# EasyEDA Pro project Armour_Round.eprj, board PCB1
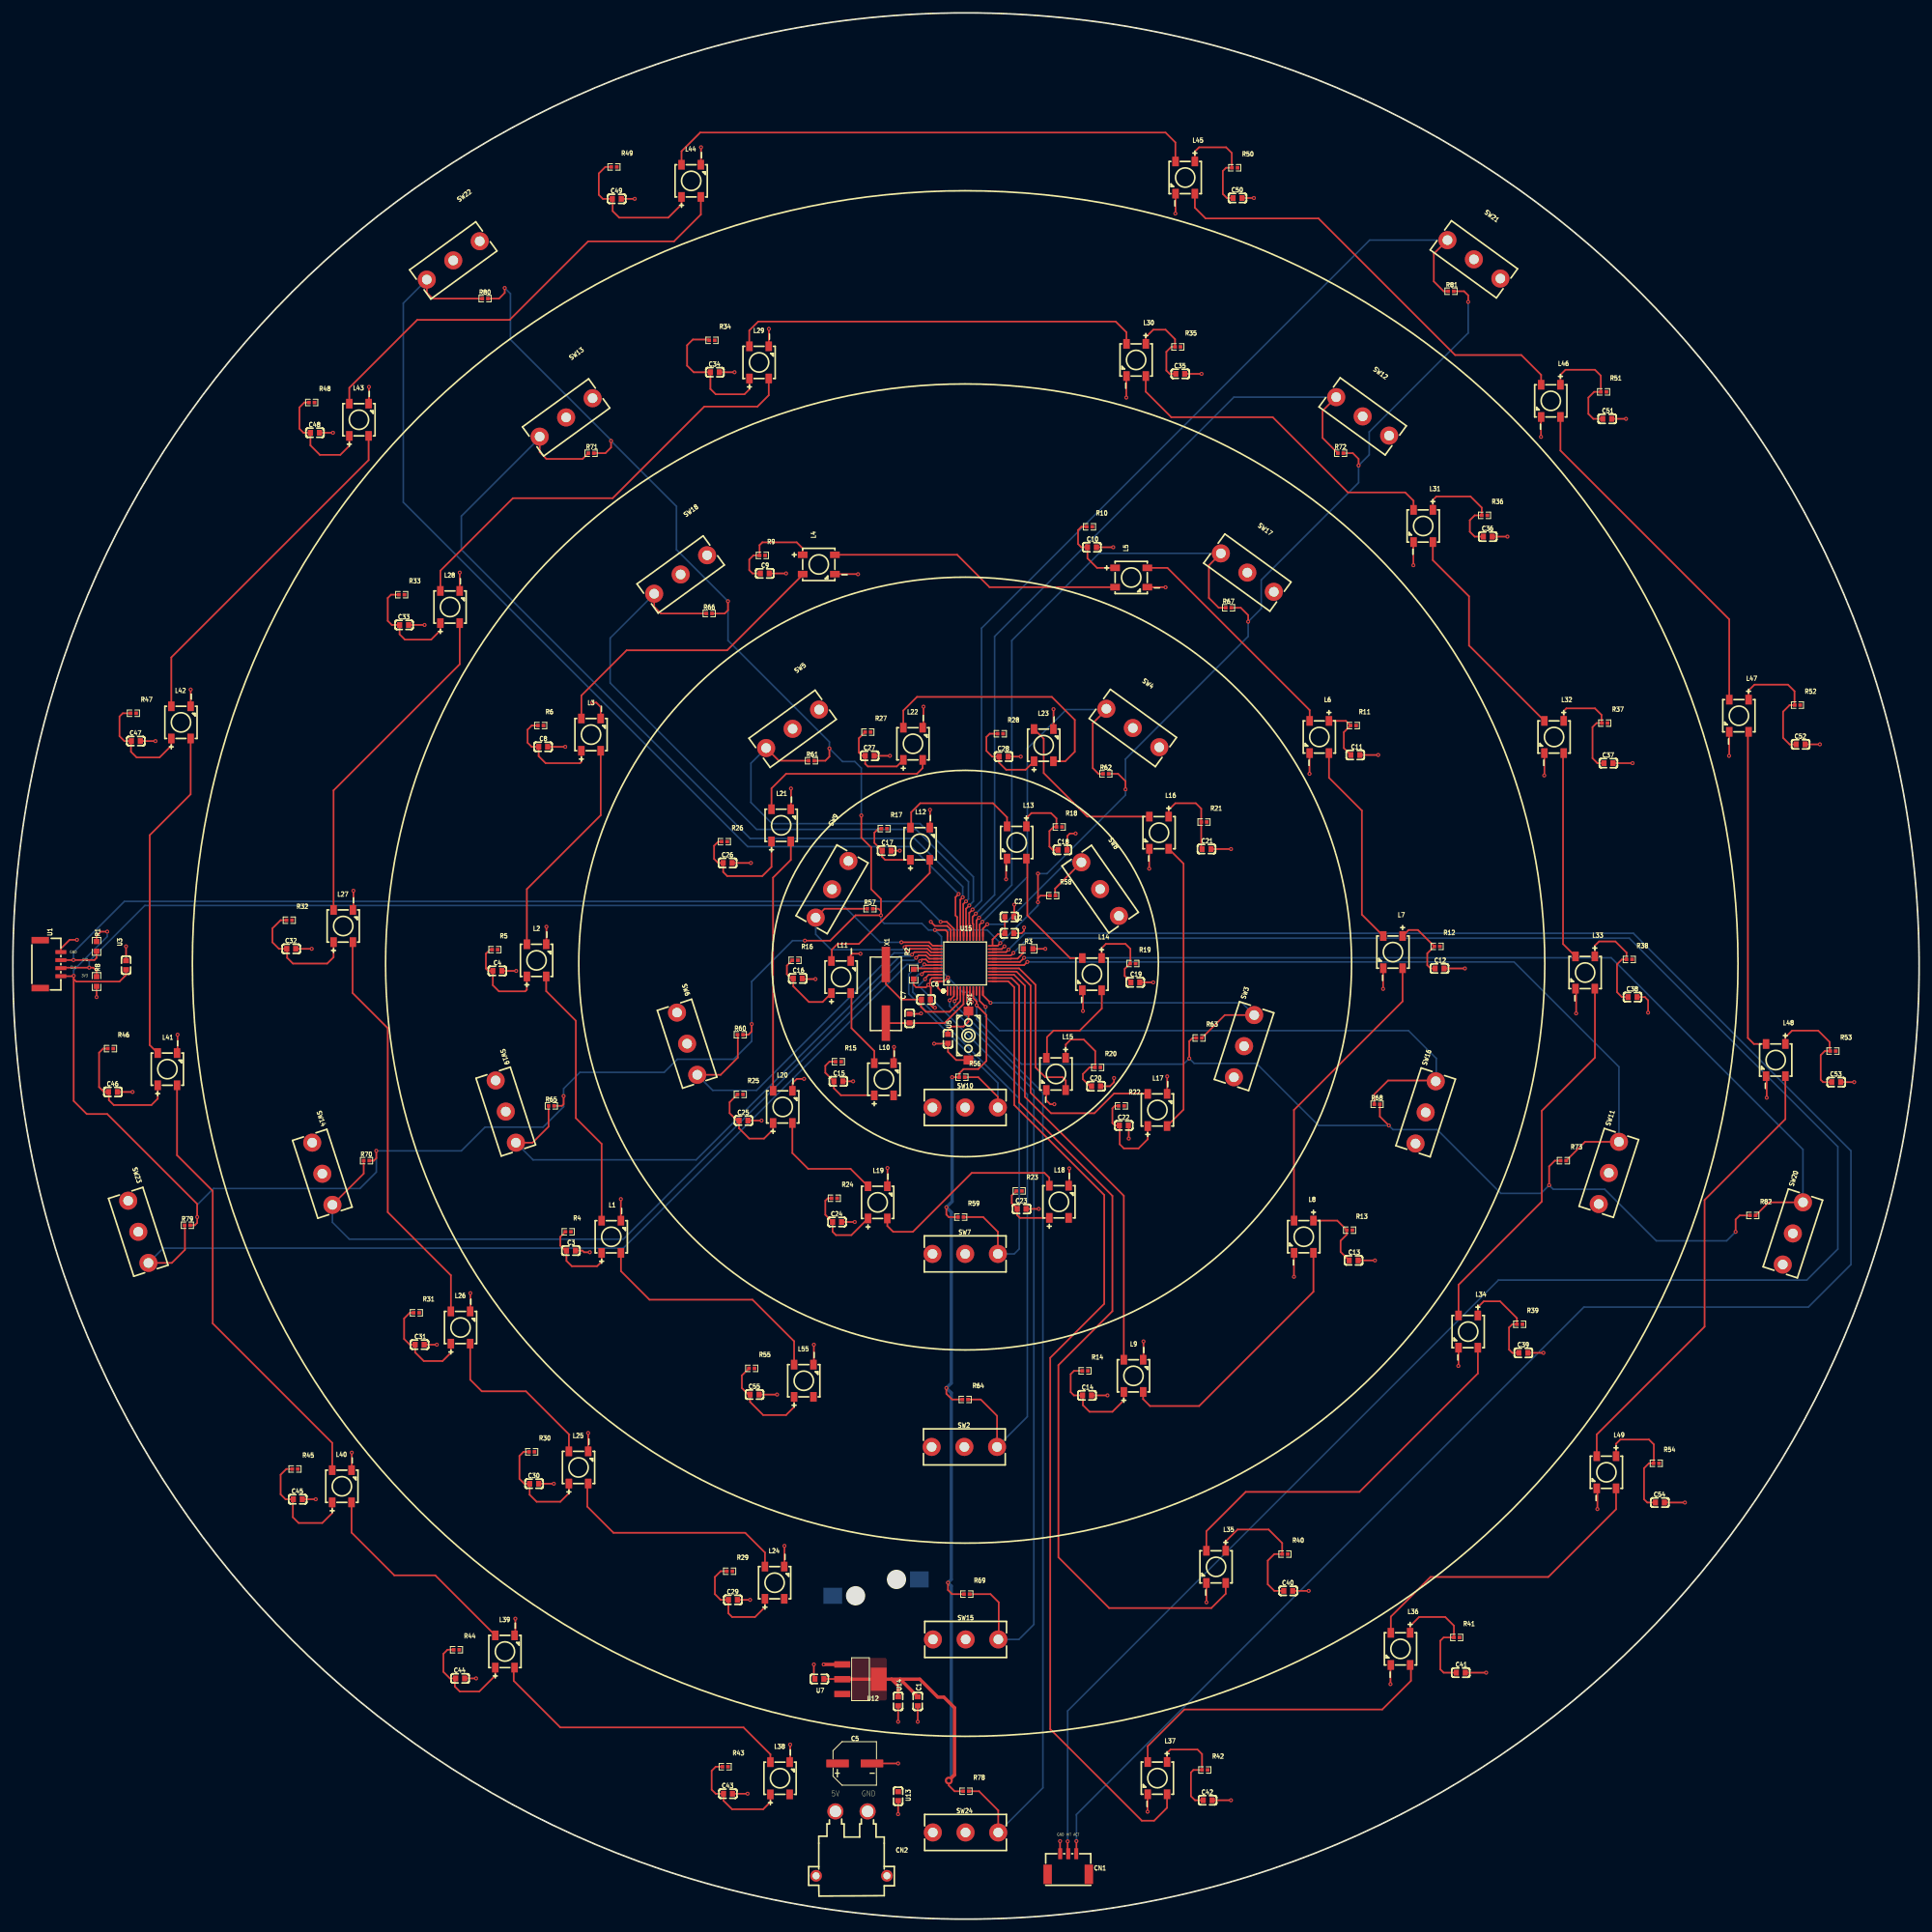
[diagram p1: board, top side]
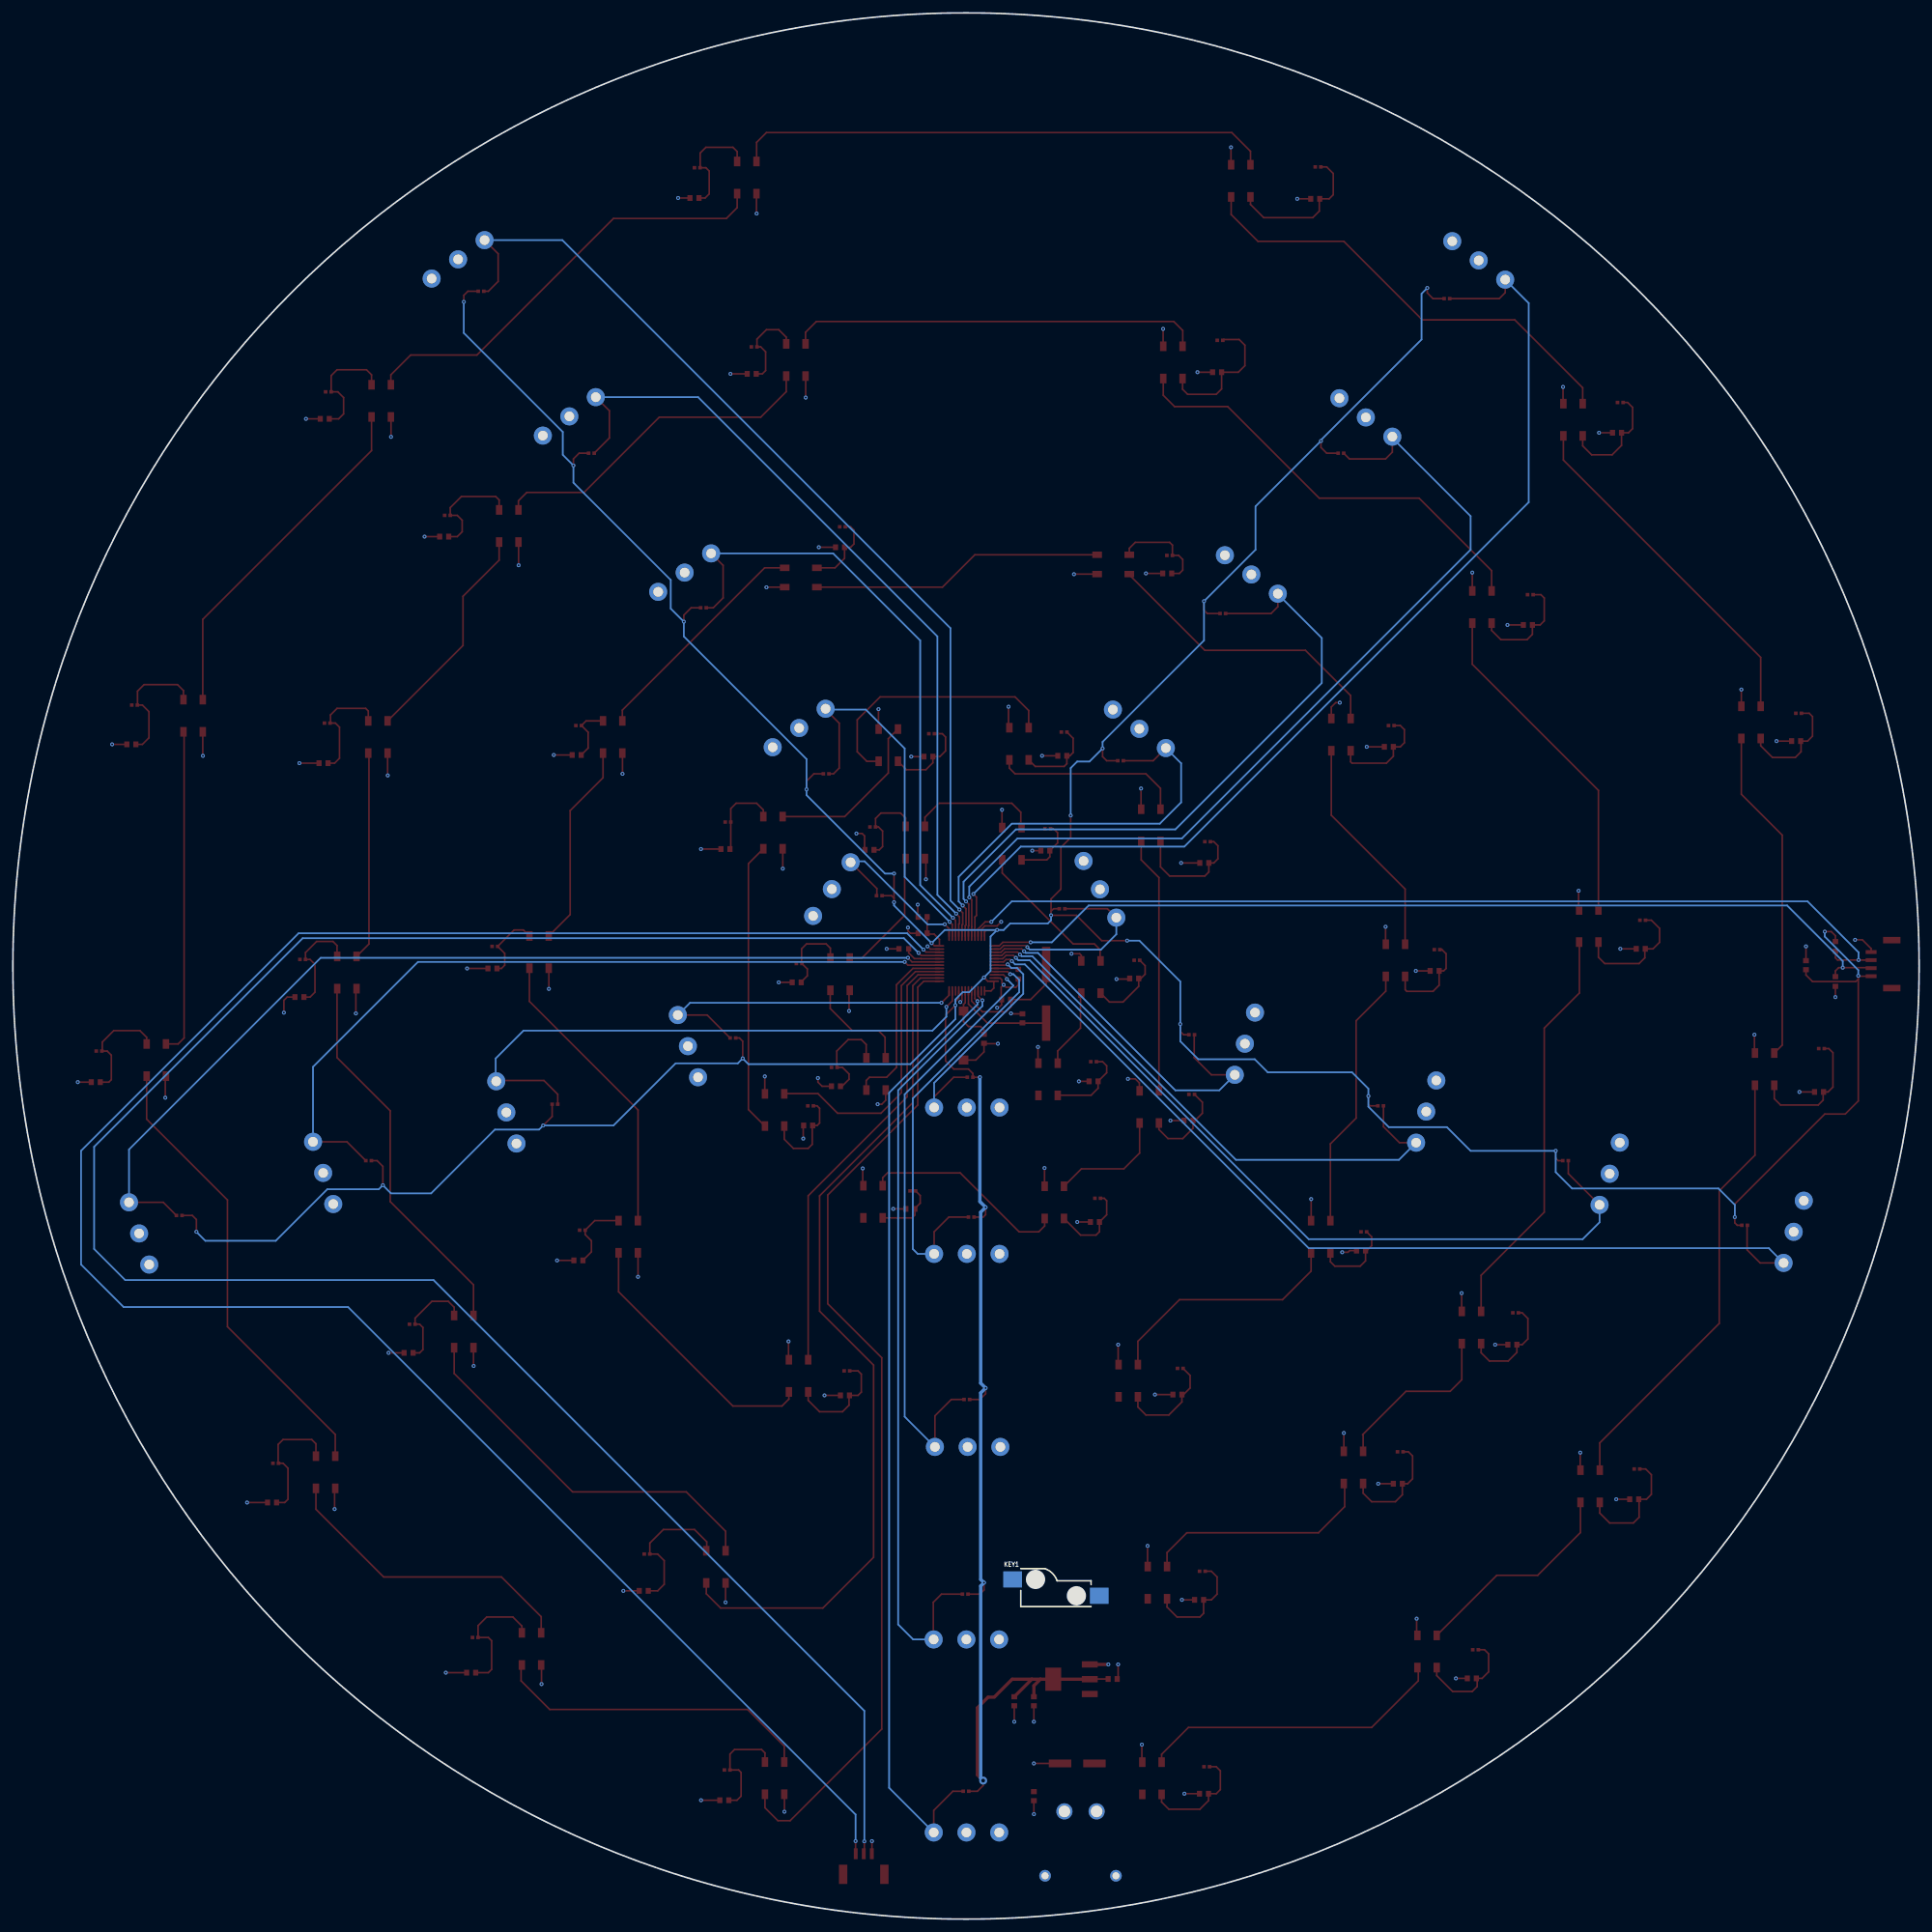
[diagram p2: board, bottom side, seen from below]

Outline 296 x 296 mm; copper layers: Top Layer, Bottom Layer. Coordinates in mm from the lower left corner of the outline.
Outline path: circle c148,148 r148
Stack: Top Layer 0.035mm / Dielectric1 1.51mm FR4 er 4.5 / Bottom Layer 0.035mm

## Design rules (mm)
spacing safeClearance (default): track to track 0.152, other pairs 0.152 to 0.3
track width trackWidth (default): min 0.127, default 0.254, max 2.54
differential pair differentialPair (default): width min 0.127, default 0.254, max 2.54; gap min 0.152, default 0.152
via viaSize (default): diameter min 0.5, default 0.61, max 10; hole min 0.3, default 0.305, max 6

## Placement (name value [footprint] x y rotation side)
C1  4.7uF  [C0603]  140.51 33.83 90 top
C2  1uF  [C0603]  154.73 155.62 180 top
C3  100nF  [C0603]  86.66 103.8 0 top
C4  100nF  [C0603]  75.23 147.24 0 top
C5  47uF  [CAP-SMD_BD6.3-L6.6-W6.6-FD]  130.73 24.18 0 top
C6  22pF  [C0603]  141.78 142.79 180 top
C7  22pF  [C0603]  139.24 139.87 270 top
C8  100nF  [C0603]  82.34 182.04 0 top
C9  100nF  [C0603]  116.76 208.96 0 top
C10  100nF  [C0603]  167.56 213.02 0 top
C11  100nF  [C0603]  208.45 180.77 0 top
C12  100nF  [C0603]  221.53 147.62 0 top
C13  100nF  [C0603]  208.19 102.29 0 top
C14  100nF  [C0603]  166.8 81.32 0 top
C15  100nF  [C0603]  128.19 130.09 0 top
C16  100nF  [C0603]  121.88 146.07 0 top
C17  100nF  [C0603]  135.68 165.91 0 top
C18  100nF  [C0603]  162.99 166.03 0 top
C19  100nF  [C0603]  174.29 145.46 0 top
C20  100nF  [C0603]  168.19 129.33 0 top
C21  100nF  [C0603]  185.35 166.16 0 top
C22  100nF  [C0603]  172.51 123.23 0 top
C23  100nF  [C0603]  156.64 110.28 0 top
C24  100nF  [C0603]  127.98 108.25 0 top
C25  100nF  [C0603]  113.45 124 0 top
C26  100nF  [C0603]  110.99 164 0 top
C27  100nF  [C0603]  133.04 180.64 0 top
C28  100nF  [C0603]  153.84 180.51 0 top
C29  100nF  [C0603]  111.8 49.57 0 top
C30  100nF  [C0603]  80.94 67.61 0 top
C31  100nF  [C0603]  63.16 89.2 0 top
C32  100nF  [C0603]  43.22 150.67 0 top
C33  100nF  [C0603]  60.75 200.96 0 top
C34  100nF  [C0603]  109.01 240.2 0 top
C35  100nF  [C0603]  181.27 239.95 0 top
C36  100nF  [C0603]  229.03 214.68 0 top
C37  100nF  [C0603]  247.76 179.5 0 top
C38  100nF  [C0603]  251.5 143.17 0 top
C39  100nF  [C0603]  234.55 87.93 0 top
C40  100nF  [C0603]  198.04 50.97 0 top
C41  100nF  [C0603]  224.83 38.27 0 top
C42  100nF  [C0603]  185.53 18.46 0 top
C43  100nF  [C0603]  111.04 19.48 0 top
C44  100nF  [C0603]  69.45 37.38 0 top
C45  100nF  [C0603]  44.24 65.2 0 top
C46  100nF  [C0603]  15.54 128.44 0 top
C47  100nF  [C0603]  19.09 182.93 0 top
C48  100nF  [C0603]  46.91 230.8 0 top
C49  100nF  [C0603]  93.77 267.13 0 top
C50  100nF  [C0603]  190.16 267.25 0 top
C51  100nF  [C0603]  247.57 232.96 0 top
C52  100nF  [C0603]  277.61 182.42 0 top
C53  100nF  [C0603]  283.13 129.97 0 top
C54  100nF  [C0603]  255.75 64.69 0 top
C55  100nF  [C0603]  115.17 81.45 0 top
CN1  A1257WR-S-3P  [CONN-SMD_A1257WR-S-3P]  163.88 8.55 0 top
CN2  XT30PW-M  [CONN-TH_XT30PW-M]  130.22 11.73 0 top
KEY1  CPG151101S11  [TH_L10.9-W5.9-CPG151101S11]  134.03 51.48 180 bottom
L1  XL-5050RGBC-WS2812B  [LED-SMD_4P-L5.0-W5.0-BL_XL-5050RGBC]  92.92 105.95 0 top
L2  XL-5050RGBC-WS2812B  [LED-SMD_4P-L5.0-W5.0-BL_XL-5050RGBC]  81.31 148.88 0 top
L3  XL-5050RGBC-WS2812B  [LED-SMD_4P-L5.0-W5.0-BL_XL-5050RGBC]  89.77 183.93 0 top
L4  XL-5050RGBC-WS2812B  [LED-SMD_4P-L5.0-W5.0-BL_XL-5050RGBC]  125.14 210.36 270 top
L5  XL-5050RGBC-WS2812B  [LED-SMD_4P-L5.0-W5.0-BL_XL-5050RGBC]  173.65 208.32 270 top
L6  XL-5050RGBC-WS2812B  [LED-SMD_4P-L5.0-W5.0-BL_XL-5050RGBC]  202.86 183.56 180 top
L7  XL-5050RGBC-WS2812B  [LED-SMD_4P-L5.0-W5.0-BL_XL-5050RGBC]  214.29 150.16 180 top
L8  XL-5050RGBC-WS2812B  [LED-SMD_4P-L5.0-W5.0-BL_XL-5050RGBC]  200.45 105.96 180 top
L9  XL-5050RGBC-WS2812B  [LED-SMD_4P-L5.0-W5.0-BL_XL-5050RGBC]  174.01 84.36 0 top
L10  XL-5050RGBC-WS2812B  [LED-SMD_4P-L5.0-W5.0-BL_XL-5050RGBC]  135.26 130.41 0 top
L11  XL-5050RGBC-WS2812B  [LED-SMD_4P-L5.0-W5.0-BL_XL-5050RGBC]  128.6 146.28 0 top
L12  XL-5050RGBC-WS2812B  [LED-SMD_4P-L5.0-W5.0-BL_XL-5050RGBC]  140.88 166.99 0 top
L13  XL-5050RGBC-WS2812B  [LED-SMD_4P-L5.0-W5.0-BL_XL-5050RGBC]  155.87 167.18 180 top
L14  XL-5050RGBC-WS2812B  [LED-SMD_4P-L5.0-W5.0-BL_XL-5050RGBC]  167.56 146.73 180 top
L15  XL-5050RGBC-WS2812B  [LED-SMD_4P-L5.0-W5.0-BL_XL-5050RGBC]  161.97 131.24 180 top
L16  XL-5050RGBC-WS2812B  [LED-SMD_4P-L5.0-W5.0-BL_XL-5050RGBC]  177.97 168.7 180 top
L17  XL-5050RGBC-WS2812B  [LED-SMD_4P-L5.0-W5.0-BL_XL-5050RGBC]  177.72 125.65 0 top
L18  XL-5050RGBC-WS2812B  [LED-SMD_4P-L5.0-W5.0-BL_XL-5050RGBC]  162.43 111.39 0 top
L19  XL-5050RGBC-WS2812B  [LED-SMD_4P-L5.0-W5.0-BL_XL-5050RGBC]  134.28 111.3 0 top
L20  XL-5050RGBC-WS2812B  [LED-SMD_4P-L5.0-W5.0-BL_XL-5050RGBC]  119.54 126.12 0 top
L21  XL-5050RGBC-WS2812B  [LED-SMD_4P-L5.0-W5.0-BL_XL-5050RGBC]  119.3 169.84 0 top
L22  XL-5050RGBC-WS2812B  [LED-SMD_4P-L5.0-W5.0-BL_XL-5050RGBC]  139.77 182.51 0 top
L23  XL-5050RGBC-WS2812B  [LED-SMD_4P-L5.0-W5.0-BL_XL-5050RGBC]  160.06 182.29 0 top
L24  XL-5050RGBC-WS2812B  [LED-SMD_4P-L5.0-W5.0-BL_XL-5050RGBC]  118.28 52.24 0 top
L25  XL-5050RGBC-WS2812B  [LED-SMD_4P-L5.0-W5.0-BL_XL-5050RGBC]  87.84 70.14 0 top
L26  XL-5050RGBC-WS2812B  [LED-SMD_4P-L5.0-W5.0-BL_XL-5050RGBC]  69.51 91.87 0 top
L27  XL-5050RGBC-WS2812B  [LED-SMD_4P-L5.0-W5.0-BL_XL-5050RGBC]  51.29 154.21 0 top
L28  XL-5050RGBC-WS2812B  [LED-SMD_4P-L5.0-W5.0-BL_XL-5050RGBC]  67.88 203.74 0 top
L29  XL-5050RGBC-WS2812B  [LED-SMD_4P-L5.0-W5.0-BL_XL-5050RGBC]  115.87 241.73 0 top
L30  XL-5050RGBC-WS2812B  [LED-SMD_4P-L5.0-W5.0-BL_XL-5050RGBC]  174.42 242.11 180 top
L31  XL-5050RGBC-WS2812B  [LED-SMD_4P-L5.0-W5.0-BL_XL-5050RGBC]  218.99 216.33 180 top
L32  XL-5050RGBC-WS2812B  [LED-SMD_4P-L5.0-W5.0-BL_XL-5050RGBC]  239.31 183.56 180 top
L33  XL-5050RGBC-WS2812B  [LED-SMD_4P-L5.0-W5.0-BL_XL-5050RGBC]  244.14 146.98 180 top
L34  XL-5050RGBC-WS2812B  [LED-SMD_4P-L5.0-W5.0-BL_XL-5050RGBC]  225.98 91.23 180 top
L35  XL-5050RGBC-WS2812B  [LED-SMD_4P-L5.0-W5.0-BL_XL-5050RGBC]  186.83 54.7 180 top
L36  XL-5050RGBC-WS2812B  [LED-SMD_4P-L5.0-W5.0-BL_XL-5050RGBC]  215.47 41.96 180 top
L37  XL-5050RGBC-WS2812B  [LED-SMD_4P-L5.0-W5.0-BL_XL-5050RGBC]  177.72 21.89 180 top
L38  XL-5050RGBC-WS2812B  [LED-SMD_4P-L5.0-W5.0-BL_XL-5050RGBC]  119.13 21.87 0 top
L39  XL-5050RGBC-WS2812B  [LED-SMD_4P-L5.0-W5.0-BL_XL-5050RGBC]  76.41 41.56 0 top
L40  XL-5050RGBC-WS2812B  [LED-SMD_4P-L5.0-W5.0-BL_XL-5050RGBC]  51.09 67.21 0 top
L41  XL-5050RGBC-WS2812B  [LED-SMD_4P-L5.0-W5.0-BL_XL-5050RGBC]  23.99 131.98 0 top
L42  XL-5050RGBC-WS2812B  [LED-SMD_4P-L5.0-W5.0-BL_XL-5050RGBC]  26.1 185.83 0 top
L43  XL-5050RGBC-WS2812B  [LED-SMD_4P-L5.0-W5.0-BL_XL-5050RGBC]  53.74 232.82 0 top
L44  XL-5050RGBC-WS2812B  [LED-SMD_4P-L5.0-W5.0-BL_XL-5050RGBC]  105.33 269.92 0 top
L45  XL-5050RGBC-WS2812B  [LED-SMD_4P-L5.0-W5.0-BL_XL-5050RGBC]  182.04 270.43 180 top
L46  XL-5050RGBC-WS2812B  [LED-SMD_4P-L5.0-W5.0-BL_XL-5050RGBC]  238.8 235.76 180 top
L47  XL-5050RGBC-WS2812B  [LED-SMD_4P-L5.0-W5.0-BL_XL-5050RGBC]  268.01 186.86 180 top
L48  XL-5050RGBC-WS2812B  [LED-SMD_4P-L5.0-W5.0-BL_XL-5050RGBC]  273.73 133.39 180 top
L49  XL-5050RGBC-WS2812B  [LED-SMD_4P-L5.0-W5.0-BL_XL-5050RGBC]  247.44 69.39 180 top
L55  XL-5050RGBC-WS2812B  [LED-SMD_4P-L5.0-W5.0-BL_XL-5050RGBC]  122.81 83.6 0 top
R1  10kΩ  [R0603]  13 151.05 90 top
R2  10kΩ  [R0603]  139.87 146.73 270 top
R3  10kΩ  [R0603]  157.65 150.67 0 top
R4  33  [R0402]  86.23 106.72 180 top
R5  33  [R0402]  74.85 150.54 180 top
R6  33  [R0402]  81.96 185.34 180 top
R8  10kΩ  [R0603]  13 145.6 90 top
R9  33  [R0402]  116.38 211.75 180 top
R10  33  [R0402]  167.18 216.2 180 top
R11  33  [R0402]  208.15 185.34 180 top
R12  33  [R0402]  221.15 151.05 180 top
R13  33  [R0402]  207.56 106.98 180 top
R14  33  [R0402]  166.49 85.13 180 top
R15  33  [R0402]  128.19 133.14 180 top
R16  33  [R0402]  121.46 148.89 180 top
R17  33  [R0402]  135.3 169.34 180 top
R18  33  [R0402]  162.48 169.59 180 top
R19  33  [R0402]  173.91 148.38 180 top
R20  33  [R0402]  168.45 132.25 180 top
R21  33  [R0402]  184.96 170.35 180 top
R22  33  [R0402]  172.13 126.28 180 top
R23  33  [R0402]  156.25 113.07 180 top
R24  33  [R0402]  127.55 111.93 180 top
R25  33  [R0402]  112.95 128.06 180 top
R26  33  [R0402]  110.48 167.3 180 top
R27  33  [R0402]  132.76 184.32 180 top
R28  33  [R0402]  153.33 184.07 180 top
R29  33  [R0402]  111.3 54.02 180 top
R30  33  [R0402]  80.56 72.56 180 top
R31  33  [R0402]  62.66 94.15 180 top
R32  33  [R0402]  42.92 155.11 180 top
R33  33  [R0402]  60.37 205.66 180 top
R34  33  [R0402]  108.55 245.16 180 top
R35  33  [R0402]  180.89 244.14 180 top
R36  33  [R0402]  228.52 217.98 180 top
R37  33  [R0402]  247.19 185.72 180 top
R38  33  [R0402]  251 149.02 180 top
R39  33  [R0402]  233.98 92.37 180 top
R40  33  [R0402]  197.53 56.69 180 top
R41  33  [R0402]  224.2 43.73 180 top
R42  33  [R0402]  185.08 23.16 180 top
R43  33  [R0402]  110.61 23.67 180 top
R44  33  [R0402]  68.88 41.83 180 top
R45  33  [R0402]  43.81 69.9 180 top
R46  33  [R0402]  15.16 135.17 180 top
R47  33  [R0402]  18.71 187.24 180 top
R48  33  [R0402]  46.4 235.5 180 top
R49  33  [R0402]  93.34 272.08 180 top
R50  33  [R0402]  189.73 271.95 180 top
R51  33  [R0402]  247.01 237.15 180 top
R52  33  [R0402]  277.11 188.51 180 top
R53  33  [R0402]  282.62 134.79 180 top
R54  33  [R0402]  255.19 70.78 180 top
R55  33  [R0402]  114.73 85.52 180 top
R56  10kΩ  [R0402]  147.36 130.73 180 top
R57  10kΩ  [R0402]  133.09 156.89 0 top
R58  10kΩ  [R0402]  161.46 158.92 180 top
R59  10kΩ  [R0402]  147.19 109.01 180 top
R60  10kΩ  [R0402]  112.95 137.33 0 top
R61  10kΩ  [R0402]  124 179.88 0 top
R62  10kΩ  [R0402]  169.72 177.84 0 top
R63  10kΩ  [R0402]  184.19 136.82 180 top
R64  10kΩ  [R0402]  147.87 80.69 180 top
R65  10kΩ  [R0402]  83.61 126.28 0 top
R66  10kΩ  [R0402]  108.12 202.74 0 top
R67  10kΩ  [R0402]  188.77 203.63 0 top
R68  10kΩ  [R0402]  211.83 126.54 0 top
R69  10kΩ  [R0402]  148.13 50.46 180 top
R70  10kΩ  [R0402]  54.91 117.77 0 top
R71  10kΩ  [R0402]  89.78 227.63 0 top
R72  10kΩ  [R0402]  206.17 227.63 0 top
R73  10kΩ  [R0402]  240.76 117.77 180 top
R78  10kΩ  [R0402]  148 19.86 180 top
R79  10kΩ  [R0402]  27.1 107.74 0 top
R80  10kΩ  [R0402]  73.32 251.63 0 top
R81  10kΩ  [R0402]  223.31 252.78 0 top
R82  10kΩ  [R0402]  270.17 109.26 180 top
SW1  -  [KEY-SMD_L6.2-W3.6-LS8.0]  148.38 137.2 90 top
SW2  K9-1267H  [SW-TH_K9-1267H]  147.75 73.32 0 top
SW3  K9-1267H  [SW-TH_K9-1267H]  191.18 135.55 72 top
SW4  K9-1267H  [SW-TH_K9-1267H]  173.91 184.96 144 top
SW5  K9-1267H  [SW-TH_K9-1267H]  121.08 184.83 216 top
SW6  K9-1267H  [SW-TH_K9-1267H]  104.69 135.94 288 top
SW7  K9-1267H  [SW-TH_K9-1267H]  147.87 103.3 0 top
SW8  K9-1267H  [SW-TH_K9-1267H]  168.83 159.94 125 top
SW9  K9-1267H  [SW-TH_K9-1267H]  127.2 159.91 240 top
SW10  K9-1267H  [SW-TH_K9-1267H]  147.87 126.03 0 top
SW11  K9-1267H  [SW-TH_K9-1267H]  247.82 115.87 72 top
SW12  K9-1267H  [SW-TH_K9-1267H]  209.59 233.34 144 top
SW13  K9-1267H  [SW-TH_K9-1267H]  85.91 233.18 216 top
SW14  K9-1267H  [SW-TH_K9-1267H]  48.05 115.74 288 top
SW15  K9-1267H  [SW-TH_K9-1267H]  147.94 43.43 0 top
SW16  K9-1267H  [SW-TH_K9-1267H]  219.37 125.27 72 top
SW17  K9-1267H  [SW-TH_K9-1267H]  191.69 209.09 144 top
SW18  K9-1267H  [SW-TH_K9-1267H]  103.69 208.8 216 top
SW19  K9-1267H  [SW-TH_K9-1267H]  76.54 125.39 288 top
SW20  K9-1267H  [SW-TH_K9-1267H]  276.4 106.47 72 top
SW21  K9-1267H  [SW-TH_K9-1267H]  226.87 257.73 144 top
SW22  K9-1267H  [SW-TH_K9-1267H]  68.38 257.56 216 top
SW23  K9-1267H  [SW-TH_K9-1267H]  19.48 106.72 288 top
SW24  K9-1267H  [SW-TH_K9-1267H]  147.93 13.46 0 top
U1  -  [CONN-SMD_GH1.25-4PWBPZ]  5.85 148.29 90 top
U2  100nf  [C0603]  154.73 153.08 180 top
U3  100nf  [C0603]  17.57 148.13 270 top
U5  100nf  [C0603]  145.21 136.7 90 top
U7  100nf  [C0603]  125.23 37.29 0 top
U12  -  [SOT-223-4_L6.5-W3.5-P2.30-LS7.0-BR]  131.62 37.26 180 top
U13  100nf  [C0603]  137.46 19.09 90 top
U14  100nf  [C0603]  137.46 33.83 90 top
U15  STM32F103CBT6  [LQFP-48_L7.0-W7.0-P0.50-LS9.0-BL]  147.87 148.38 0 top
X1  8MHz  [HC-49S_L11.4-W4.8]  135.55 143.68 90 top

## Footprints (pads in the part's own frame, mm; a bottom-side part is the same pattern mirrored in y, then rotated)
C0603
  rect 0.8x0.9 smd: 1(-0.7,0) 2(0.7,0)
CAP-SMD_BD6.3-L6.6-W6.6-FD
  rect 3.5x1.2 smd: 1(-2.67,0) 2(2.67,0)
CONN-SMD_A1257WR-S-3P
  rect 0.6x1.7 smd: 1(1.25,1.6) 2(0,1.6) 3(-1.25,1.6)
  rect 1.3x3 smd: 4(3.2,-1.6) 5(-3.2,-1.6)
CONN-SMD_GH1.25-4PWBPZ
  rect 0.6x1.7 smd: 1(-1.875,-1.601) 2(-0.625,-1.601) 3(0.625,-1.601) 4(1.875,-1.601)
  rect 1x2.7 smd: 5(-3.725,1.601) 6(3.725,1.601)
CONN-TH_XT30PW-M
  round 2.5 hole 1.8: 1(-2.5,5) 2(2.5,5)
  round 1.8 hole 1.1: 3(5.5,-5) 4(-5.5,-5)
HC-49S_L11.4-W4.8
  rect 5.5x1.3 smd: 1(-4.553,0) 2(4.553,0)
KEY-SMD_L6.2-W3.6-LS8.0
  rect 1.399x1.501 smd: 1(-3.8,0) 2(3.8,0)
LED-SMD_4P-L5.0-W5.0-BL_XL-5050RGBC
  rect 1x1.5 smd: 1(-1.5,-2.5) 2(1.5,-2.5) 3(1.5,2.5) 4(-1.5,2.5)
LQFP-48_L7.0-W7.0-P0.50-LS9.0-BL
  oval 0.27x1.5 smd: 1(-2.75,-4.25) 2(-2.25,-4.25) 3(-1.75,-4.25) 4(-1.25,-4.25) 5(-0.75,-4.25) 6(-0.25,-4.25) 7(0.25,-4.25) 8(0.75,-4.25) 9(1.25,-4.25) 10(1.75,-4.25) 11(2.25,-4.25) 12(2.75,-4.25) 25(2.75,4.25) 26(2.25,4.25) 27(1.75,4.25) 28(1.25,4.25) 29(0.75,4.25) 30(0.25,4.25) 31(-0.25,4.25) 32(-0.75,4.25) 33(-1.25,4.25) 34(-1.75,4.25) 35(-2.25,4.25) 36(-2.75,4.25)
  oval 1.5x0.27 smd: 13(4.25,-2.75) 14(4.25,-2.25) 15(4.25,-1.75) 16(4.25,-1.25) 17(4.25,-0.75) 18(4.25,-0.25) 19(4.25,0.25) 20(4.25,0.75) 21(4.25,1.25) 22(4.25,1.75) 23(4.25,2.25) 24(4.25,2.75) 37(-4.25,2.75) 38(-4.25,2.25) 39(-4.25,1.75) 40(-4.25,1.25) 41(-4.25,0.75) 42(-4.25,0.25) 43(-4.25,-0.25) 44(-4.25,-0.75) 45(-4.25,-1.25) 46(-4.25,-1.75) 47(-4.25,-2.25) 48(-4.25,-2.75)
R0402
  rect 0.566x0.54 smd: 1(-0.433,0) 2(0.433,0)
R0603
  rect 0.806x0.864 smd: 1(-0.753,0) 2(0.753,0)
SOT-223-4_L6.5-W3.5-P2.30-LS7.0-BR
  rect 2.469x0.981 smd: 1(2.834,-2.299) 2(2.834,0) 3(2.834,2.301)
  rect 2.469x3.599 smd: 4(-2.834,0)
SW-TH_K9-1267H
  round 2.8 hole 1.5: 1(-5.08,0) 2(0,0) 3(5.08,0)
TH_L10.9-W5.9-CPG151101S11
  rect 2.9x2.5 smd: 1(-6.725,1.27) 2(6.725,-1.27)

## Nets
+3.3V: C1.2 C2.2 R1.2 R56.2 R57.2 R58.2 R59.2 R60.2 R61.2 R62.2 R63.2 R64.2 R65.2 R66.2 R67.2 R68.2 R69.2 R70.2 R71.2 R72.2 R73.2 R78.2 R79.2 R80.2 R81.2 R82.2 U1.1 U2.2 U3.2 U7.2 U12.2 U12.4 U14.2 U15.1 U15.9 U15.24 U15.36 U15.48
+5V: C5.1 CN2.1 R4.1 R5.1 R6.1 R9.1 R10.1 R11.1 R12.1 R13.1 R14.1 R15.1 R16.1 R17.1 R18.1 R19.1 R20.1 R21.1 R22.1 R23.1 R24.1 R25.1 R26.1 R27.1 R28.1 R29.1 R30.1 R31.1 R32.1 R33.1 R34.1 R35.1 R36.1 R37.1 R38.1 R39.1 R40.1 R41.1 R42.1 R43.1 R44.1 R45.1 R46.1 R47.1 R48.1 R49.1 R50.1 R51.1 R52.1 R53.1 R54.1 R55.1 U12.3 U13.2
AGND: C1.1 C2.1 C3.2 C4.2 C5.2 C6.1 C7.1 C8.2 C9.2 C10.2 C11.2 C12.2 C13.2 C14.2 C15.2 C16.2 C17.2 C18.2 C19.2 C20.2 C21.2 C22.2 C23.2 C24.2 C25.2 C26.2 C27.2 C28.2 C29.2 C30.2 C31.2 C32.2 C33.2 C34.2 C35.2 C36.2 C37.2 C38.2 C39.2 C40.2 C41.2 C42.2 C43.2 C44.2 C45.2 C46.2 C47.2 C48.2 C49.2 C50.2 C51.2 C52.2 C53.2 C54.2 C55.2 CN1.3 CN2.2 L1.3 L2.3 L3.3 L4.3 L5.3 L6.3 L7.3 L8.3 L9.3 L10.3 L11.3 L12.3 L13.3 L14.3 L15.3 L16.3 L17.3 L18.3 L19.3 L20.3 L21.3 L22.3 L23.3 L24.3 L25.3 L26.3 L27.3 L28.3 L29.3 L30.3 L31.3 L32.3 L33.3 L34.3 L35.3 L36.3 L37.3 L38.3 L39.3 L40.3 L41.3 L42.3 L43.3 L44.3 L45.3 L46.3 L47.3 L48.3 L49.3 L55.3 R2.2 R3.2 R8.1 SW1.1 SW2.1 SW3.1 SW4.1 SW5.1 SW6.1 SW7.1 SW8.1 SW9.1 SW10.1 SW11.1 SW12.1 SW13.1 SW14.1 SW15.1 SW16.1 SW17.1 SW18.1 SW19.1 SW20.1 SW21.1 SW22.1 SW23.1 SW24.1 U1.4 U2.1 U3.1 U5.1 U7.1 U12.1 U13.1 U14.1 U15.8 U15.23 U15.35 U15.47
1_1: R78.1 SW24.3 U15.4
1_2: R79.1 SW23.3 U15.42
1_3: R80.1 SW22.3 U15.33
1_4: R81.1 SW21.3 U15.29
1_5: R82.1 SW20.3 U15.19
2_1: R69.1 SW15.3 U15.3
2_2: R70.1 SW14.3 U15.41
2_3: R71.1 SW13.3 U15.32
2_4: R72.1 SW12.3 U15.28
2_5: R73.1 SW11.3 U15.18
3_1: R64.1 SW2.3 U15.46
3_2: R65.1 SW19.3 U15.40
3_3: R66.1 SW18.3 U15.31
3_4: R67.1 SW17.3 U15.27
3_5: R68.1 SW16.3 U15.11
4_1: R59.1 SW7.3 U15.45
4_2: R60.1 SW6.3 U15.39
4_3: R61.1 SW5.3 U15.30
4_4: R62.1 SW4.3 U15.26
4_5: R63.1 SW3.3 U15.12
5_1: R56.1 SW10.3 U15.43
5_2: R57.1 SW9.3 U15.38
5_3: R58.1 SW8.3 U15.25
ACT: CN1.1 U15.22
DIN1: L37.4 U15.13
DIN2: L35.4 U15.14
DIN3: L9.4 U15.15
DIN4: L17.4 U15.16
DIN5: L15.4 U15.17
HIT: CN1.2 U15.21
NRST: SW1.2 U5.2 U15.7
SWCLK: R8.2 U1.2 U15.37
SWDIO: R1.1 U1.3 U15.34
$1N2619: U15.2
$1N2625: U15.10
$1N2663: C6.2 U15.5 X1.2
$1N2664: C7.2 U15.6 X1.1
$1N2668: R3.1 U15.20
$1N2669: R2.1 U15.44
$1N14230: C55.1 L55.1 R55.2
$1N14232: L55.2
$1N14233: L1.2 L55.4
$1N15135: C3.1 L1.1 R4.2
$1N15136: L1.4 L2.2
$1N15772: C4.1 L2.1 R5.2
$1N15776: C8.1 L3.1 R6.2
$1N15778: L2.4 L3.2
$1N15779: L3.4 L4.2
$1N16353: C9.1 L4.1 R9.2
$1N16357: C10.1 L5.1 R10.2
$1N16359: L4.4 L5.2
$1N16360: L5.4 L6.2
$1N19976: C11.1 L6.1 R11.2
$1N19979: C12.1 L7.1 R12.2
$1N19981: L6.4 L7.2
$1N19982: L7.4 L8.2
$1N20579: C13.1 L8.1 R13.2
$1N20582: C14.1 L9.1 R14.2
$1N20584: L8.4 L9.2
$1N21259: C15.1 L10.1 R15.2
$1N21262: C16.1 L11.1 R16.2
$1N21264: L10.4 L11.2
$1N21265: L11.4 L12.2
$1N21266: L10.2
$1N21809: C17.1 L12.1 R17.2
$1N21812: C18.1 L13.1 R18.2
$1N21814: L12.4 L13.2
$1N21815: L13.4 L14.2
$1N22363: C19.1 L14.1 R19.2
$1N22366: C20.1 L15.1 R20.2
$1N22368: L14.4 L15.2
$1N23436: C21.1 L16.1 R21.2
$1N23439: C22.1 L17.1 R22.2
$1N23441: L16.4 L17.2
$1N24613: C23.1 L18.1 R23.2
$1N24616: C24.1 L19.1 R24.2
$1N24618: L18.4 L19.2
$1N24619: L18.2
$1N24621: C25.1 L20.1 R25.2
$1N24624: C26.1 L21.1 R26.2
$1N24626: L20.4 L21.2
$1N24628: C27.1 L22.1 R27.2
$1N24631: C28.1 L23.1 R28.2
$1N24633: L22.4 L23.2
$1N24634: L16.2 L23.4
$1N24635: L21.4 L22.2
$1N24636: L19.4 L20.2
$1N26867: C29.1 L24.1 R29.2
$1N26868: L24.2
$1N26871: C30.1 L25.1 R30.2
$1N26873: L24.4 L25.2
$1N26877: C33.1 L28.1 R33.2
$1N26880: C34.1 L29.1 R34.2
$1N26882: L28.4 L29.2
$1N26883: L27.4 L28.2
$1N26885: C32.1 L27.1 R32.2
$1N26886: L25.4 L26.2
$1N26887: L26.4 L27.2
$1N26889: C31.1 L26.1 R31.2
$1N26891: C35.1 L30.1 R35.2
$1N26894: C36.1 L31.1 R36.2
$1N26896: L30.4 L31.2
$1N26898: C37.1 L32.1 R37.2
$1N26901: C38.1 L33.1 R38.2
$1N26903: L32.4 L33.2
$1N26904: L33.4 L34.2
$1N26905: L31.4 L32.2
$1N26906: L29.4 L30.2
$1N28307: C39.1 L34.1 R39.2
$1N28310: C40.1 L35.1 R40.2
$1N28312: L34.4 L35.2
$1N28912: C41.1 L36.1 R41.2
$1N28915: C42.1 L37.1 R42.2
$1N28917: L36.4 L37.2
$1N30856: C43.1 L38.1 R43.2
$1N30857: L38.2
$1N30860: C44.1 L39.1 R44.2
$1N30862: L38.4 L39.2
$1N30866: C47.1 L42.1 R47.2
$1N30869: C48.1 L43.1 R48.2
$1N30871: L42.4 L43.2
$1N30872: L41.4 L42.2
$1N30874: C46.1 L41.1 R46.2
$1N30875: L39.4 L40.2
$1N30876: L40.4 L41.2
$1N30878: C45.1 L40.1 R45.2
$1N30880: C49.1 L44.1 R49.2
$1N30883: C50.1 L45.1 R50.2
$1N30885: L44.4 L45.2
$1N30887: C51.1 L46.1 R51.2
$1N30890: C52.1 L47.1 R52.2
$1N30892: L46.4 L47.2
$1N30893: L45.4 L46.2
$1N30894: L43.4 L44.2
$1N30896: C53.1 L48.1 R53.2
$1N30899: C54.1 L49.1 R54.2
$1N30901: L48.4 L49.2
$1N30902: L36.2 L49.4
$1N30903: L47.4 L48.2

Pads without a net: CN1 4 5; CN2 3 4; KEY1 1 2; SW2 2; SW3 2; SW4 2; SW5 2; SW6 2; SW7 2; SW8 2; SW9 2; SW10 2; SW11 2; SW12 2; SW13 2; SW14 2; SW15 2; SW16 2; SW17 2; SW18 2; SW19 2; SW20 2; SW21 2; SW22 2; SW23 2; SW24 2; U1 5 6

## Via types
v1: diameter 0.61, hole 0.305, Top Layer to Bottom Layer, 182 vias
v2: diameter 1.22, hole 0.61, Top Layer to Bottom Layer, 1 via

## Routing (per net, layer and track width the routed paths; a pad name or vN(x,y) marks a point on that pad's centre or on a via; arc(x,y) is an arc through that point)
+3.3V: length 893.2
  Top Layer w0.254: U15.36 145.12,153.29 144.82,153.59 v1(143.17,153.59) ; v1(92.88,229.53) 92.88,228.52 91.99,227.63 R71.2 ; v1(145.84,130.73) R56.2 146.93,131.31 147.62,132 149.91,132 151.17,133.27 151.17,140.38 v1(149.65,141.9) 149.65,142.48 149.12,143 U15.9 ; R78.2 146.22,19.86 145.33,20.75 v2(145.33,21.51) ; R60.2 114.22,137.33 114.73,137.84 v1(114.73,138.98) ; v1(122.98,151.94) 126.92,151.94 130.85,155.87 v1(134.79,155.87) 134.79,156.51 ; R67.2 190.67,203.63 191.81,202.48 v1(191.81,201.47) ; 134.79,156.51 134.79,158.41 133.27,159.94 133.27,166.42 131.74,167.94 v1(131.74,171.37) ; 134.79,156.51 134.41,156.89 R57.2 ; R70.2 56.05,117.77 56.43,118.16 v1(56.43,119.3) ; R79.2 28.24,107.74 28.62,108.12 v1(28.62,109.01) 28.62,111.04 14.65,125.01 11.47,125.01 9.44,127.05 9.44,145.97 ; R58.2 159.56,158.92 159.18,158.54 ; 159.18,158.54 v1(159.18,157.91) ; 159.18,158.54 v1(159.18,162.35) ; R72.2 208.07,227.63 208.96,226.74 v1(208.96,225.72) ; v1(111.04,204.64) 111.04,203.25 110.53,202.74 R66.2 ; 9.44,145.97 9.82,145.59 16.55,145.59 17.57,146.6 U3.2 ; 9.44,145.97 v1(9.44,146.48) 9.38,146.42 U1.1 ; v1(145.21,146.22) 144.61,145.63 U15.48 143.68,145.57 143.68,144.57 144.12,144.13 U15.1 ; v1(14.65,153.33) 13.63,153.33 13,152.7 R1.2 ; R82.2 268.14,109.26 267.51,108.63 v1(267.51,106.72) ; v1(172.76,175.43) 172.76,176.7 171.62,177.84 R62.2 ; v1(153.33,151.56) 152.91,151.13 U15.24 152.12,152.12 152.95,152.95 154.03,152.95 C2.2 ; R64.2 145.84,80.69 144.95,81.58 v1(144.95,82.47) ; v1(225.98,251.12) 225.98,252.14 225.34,252.78 223.74,252.78 ; R80.2 75.48,251.63 76.37,252.52 v1(76.37,253.28) ; U7.2 128.75,37.29 U12.2 ; v1(144.95,110.53) 144.95,109.39 145.33,109.01 R59.2 ; v1(213.66,123.23) 212.26,124.63 R68.2 ; R61.2 126.16,179.88 126.79,180.51 v1(126.79,181.78) ; v1(238.55,113.96) 238.55,116.88 239.44,117.77 R73.2 ; v1(85.52,127.81) 85.52,126.54 85.26,126.28 R65.2 ; R63.2 183.18,136.82 182.67,136.32 v1(182.67,133.65) ; R69.2 145.84,50.46 145.21,51.1 v1(145.21,52.24)
  Top Layer w0.508: U12.2 U12.4 136.44,37.26 ; 136.44,37.26 137.46,36.24 U14.2 ; 136.44,37.26 137.78,37.26 ; 143.55,34.53 140.83,37.26 137.78,37.26 ; v2(145.33,21.51) 146.22,22.4 146.22,32.81 144.57,34.46 143.62,34.46 ; C1.2 137.78,37.26
  Bottom Layer w0.254: v1(122.98,151.94) 121.08,151.94 114.73,145.59 v1(114.73,138.98) 114.73,136.32 111.93,133.52 103.17,133.52 101.14,131.49 88.06,131.49 85.52,128.95 v1(85.52,127.81) 85.52,126.16 82.34,122.98 73.32,122.98 69.64,119.3 v1(56.43,119.3) 56.43,116 53.89,113.46 31.16,113.46 28.62,110.92 v1(28.62,109.01) ; v1(143.17,153.59) 142.16,153.59 141.14,154.6 135.3,154.6 134.79,155.11 v1(134.79,155.87) ; v1(143.17,153.59) 151.3,153.59 v1(153.33,151.56) 159.18,157.4 v1(159.18,157.91) ; v1(143.17,153.59) 144.19,152.57 144.19,147.24 v1(145.21,146.22) 147.49,143.94 148.51,143.94 149.65,142.79 v1(149.65,141.9) 149.65,139.75 156.64,132.76 181.78,132.76 v1(182.67,133.65) 183.43,132.89 193.08,132.89 202.74,123.23 v1(213.66,123.23) 214.29,122.6 221.15,122.6 231.06,112.69 237.28,112.69 v1(238.55,113.96) 239.19,113.33 247.19,113.33 255.19,105.33 266.11,105.33 v1(267.51,106.72) ; v1(131.74,171.37) 131.74,178.73 130.73,179.75 128.82,179.75 v1(126.79,181.78) 126.79,182.8 111.04,198.55 v1(111.04,204.64) 103.04,212.64 103.04,219.37 v1(92.88,229.53) 92.88,229.66 77.26,245.28 77.26,252.39 v1(76.37,253.28) ; v1(9.44,146.48) 9.44,147.37 14.65,152.57 v1(14.65,153.33) ; v1(159.18,162.35) 160.57,162.35 172.76,174.54 v1(172.76,175.43) 172.76,180.13 191.81,199.18 v1(191.81,201.47) 193.85,203.5 193.85,207.94 208.96,223.06 v1(208.96,225.72) 210.61,227.38 210.61,230.93 225.98,246.3 v1(225.98,251.12)
  Bottom Layer w0.508: v2(145.33,21.51) 145.71,21.89 145.71,51.73 v1(145.21,52.24) 145.71,52.75 145.71,81.71 v1(144.95,82.47) 145.71,83.23 145.71,109.77 v1(144.95,110.53) 145.84,111.42 v1(145.84,130.73)
AGND: length 333.9
  Top Layer w0.254: L47.3 266.51,180.66 v1(266.49,180.64) ; L43.3 55.29,235.37 v1(55.29,237.92) ; L19.3 135.81,113.82 v1(135.81,116.63) ; v1(160.32,150.67) R3.2 ; v1(189.15,18.46) C42.2 ; L55.3 124.38,86.17 v1(124.38,89.2) ; v1(89.33,75.48) 89.33,72.65 L25.3 ; v1(176.19,16.68) 176.19,19.37 L37.3 ; v1(142.54,154.86) 143.17,154.22 145.08,154.22 145.62,153.68 U15.35 ; v1(116.25,124) C25.2 ; v1(211.5,102.28) 211.49,102.29 C13.2 ; C20.2 170.35,129.33 170.99,129.97 v1(170.99,130.6) ; U5.1 145.21,135.86 ; 145.21,135.86 145.21,134.67 146.48,133.39 148.37,133.39 SW1.1 ; 145.21,135.86 145.13,135.94 v1(143.05,135.94) ; L9.3 175.56,86.92 v1(175.56,89.71) ; L38.3 120.69,24.44 v1(120.69,27.1) ; C12.2 v1(225.47,147.62) ; C14.2 v1(169.97,81.32) ; v1(142.16,145.08) 142.42,145.34 142.42,145.84 142.71,146.13 U15.47 ; v1(142.16,145.08) 142.54,144.7 142.54,142.86 C6.1 142.48,141.97 142.92,141.52 v1(143.17,141.52) ; v1(142.16,145.08) 141.78,144.7 140.25,144.7 139.87,145.08 R2.2 ; C46.2 v1(18.59,128.44) ; v1(259.63,64.69) 259.63,64.69 C54.2 ; C22.2 173.27,123.17 v1(173.27,121.2) ; C10.2 v1(170.86,213.02) ; v1(124.38,39.54) 124.38,37.44 U7.1 ; L45.3 180.54,264.86 v1(180.51,264.84) ; L12.3 142.41,169.52 v1(142.41,172.26) ; L17.3 179.24,128.17 v1(179.24,130.86) ; L24.3 119.81,54.77 v1(119.81,57.96) ; C53.2 v1(285.92,129.97) ; v1(137.46,24.18) C5.2 ; v1(161.72,126.54) 161.08,126.54 160.47,127.15 L15.3 ; v1(253.92,140.76) 253.92,142.67 253.41,143.17 C38.2 ; v1(164.03,116.57) 164.03,113.99 L18.3 ; v1(177.08,145.46) C19.2 ; v1(153.97,151.05) 153.55,150.63 U15.23 ; L41.3 25.57,134.57 v1(25.57,137.33) ; C55.2 v1(118.66,81.45) ; L32.3 237.81,177.62 v1(237.79,177.59) ; C29.2 v1(114.47,49.57) ; v1(217.47,210.23) 217.47,213.8 L31.3 ; v1(212.77,144.44) 212.77,147.63 L7.3 ; L11.3 130.09,148.8 130.09,149.65 130.35,149.91 v1(131.62,149.91) ; v1(96.56,267.13) C49.2 ; L1.3 94.41,108.46 v1(94.41,111.81) ; v1(78.15,147.24) C4.2 ; v1(136.19,180.64) C27.2 ; C47.2 v1(22.14,182.93) ; v1(184.58,239.95) C35.2 ; v1(71.04,97.2) 71.04,94.39 L26.3 ; v1(141.01,140.63) 140.95,140.57 C7.1 ; L34.3 224.48,85.92 v1(224.45,85.9) ; v1(117.39,246.93) 117.39,244.25 L29.3 ; v1(148.89,142.41) 148.62,142.68 U15.8 ; L39.3 78.02,44.17 v1(78.02,46.65) ; v1(131.24,208.83) 131.21,208.86 L4.3 ; L6.3 201.34,181.04 v1(201.34,177.84) ; v1(172.89,236.26) 172.89,239.58 L30.3 ; v1(201.21,50.97) C40.2 ; L40.3 52.62,69.75 v1(52.62,72.44) ; L13.3 154.22,164.53 v1(154.22,161.46) ; v1(120.82,175.56) 120.82,172.37 L21.3 ; L8.3 198.93,103.44 v1(198.93,99.74) ; v1(65.83,89.2) 63.87,89.2 C31.2 ; U1.4 7.45,150.71 8.81,152.06 v1(9.95,152.06) ; CN1.3 162.6,10.17 v1(162.6,12.11) ; v1(136.82,135.43) 136.82,132.98 L10.3 ; L36.3 213.91,39.41 v1(213.91,36.49) ; 117.46,208.96 v1(120.06,208.96) ; C44.2 v1(71.93,37.38) ; L2.3 82.85,151.41 v1(82.85,154.1) ; v1(141.4,188.26) 141.4,185.14 L22.3 ; v1(166.16,141.01) 166.16,144.13 L14.3 ; v1(157.02,153.97) 157.02,153.46 156.64,153.08 U2.1 ; v1(112.06,240.2) C34.2 ; v1(124.63,145.97) 122.68,145.97 C16.2 ; L42.3 27.6,188.33 v1(27.6,190.93) ; C1.1 v1(140.51,30.65) ; L33.3 242.74,144.38 v1(242.74,140.63) ; C18.2 163.75,166.1 163.75,168.19 164.13,168.57 v1(165.02,168.57) ; 13,144.84 v1(13,143.17) ; C45.2 v1(47.03,65.2) ; C11.2 v1(212.01,180.77) ; 248.27,232.96 v1(250.49,232.96) ; v1(130.47,130.09) C15.2 ; L20.3 121.08,128.65 121.08,129.84 121.71,130.47 v1(122.85,130.47) ; L16.3 176.45,166.18 v1(176.45,163.11) ; C36.2 v1(232.07,214.68) ; U3.1 v1(17.57,151.05) ; v1(89.58,103.55) 88.69,103.55 88.44,103.8 C3.2 ; v1(178.99,206.8) 178.96,206.82 L5.3 ; C52.2 v1(280.59,182.42) ; v1(161.59,187.88) 161.59,184.81 161.56,184.79 ; v1(137.71,165.91) C17.2 ; L49.3 246.04,66.78 v1(246.04,63.67) ; v1(185.34,49.19) 185.34,52.19 L35.3 ; L46.3 237.28,233.23 v1(237.28,230.17) ; v1(192.7,267.25) C50.2 ; v1(137.46,16.3) U13.1 ; v1(69.39,209.09) 69.39,206.24 69.38,206.24 ; v1(89.96,188.89) 90.6,188.89 91.27,188.22 91.27,186.43 ; v1(189.15,166.16) C21.2 ; C37.2 v1(251.5,179.5) ; v1(52.88,159.68) 52.88,156.79 L27.3 ; v1(130.73,108.25) C24.2 ; C30.2 v1(83.99,67.61) ; v1(155.49,157.53) 155.49,155.68 C2.1 ; v1(156.51,180.51) C28.2 ; U14.1 v1(137.46,30.65) ; v1(106.85,275.13) 106.85,272.44 L44.3 ; C48.2 v1(49.7,230.8) ; L48.3 272.33,130.79 v1(272.33,127.55) ; C43.2 v1(114.09,19.48) ; C39.2 v1(237.66,87.93) ; C41.2 v1(228.77,38.27) ; C8.2 v1(85.77,182.04) ; v1(159.3,110.28) C23.2 ; v1(63.93,200.96) C33.2 ; v1(46.4,150.67) C32.2 ; v1(114.6,164) C26.2
  Top Layer w0.508: v1(125.9,39.54) 128.77,39.54 U12.1
1_1: length 148.6
  Top Layer w0.254: U15.4 146.62,142.94 v1(146.22,142.54) ; R78.1 150.03,19.86 153.01,16.88 SW24.3
  Bottom Layer w0.254: v1(146.22,142.54) 146.22,142.03 159.94,128.31 159.94,20.39 SW24.3
1_2: length 152.6
  Top Layer w0.254: v1(140.89,148.76) 141.14,149.02 141.78,149.02 142.16,148.63 U15.42 ; R79.1 26.71,107.69 26.71,103.93 24.68,101.89 SW23.3
  Bottom Layer w0.254: v1(140.89,148.76) 140.38,148.25 138.86,148.25 94.79,104.19 23.34,104.19 SW23.3
1_3: length 165.4
  Top Layer w0.254: 64.27,254.58 64.27,252.55 65.2,251.63 R80.1 ; U15.33 146.62,155.6 146.37,155.85 146.37,158.69 v1(146.86,159.18)
  Bottom Layer w0.254: v1(146.86,159.18) 139.49,166.54 114.09,166.54 60.62,220.01 60.62,250.93 64.27,254.58
1_4: length 156.1
  Top Layer w0.254: v1(149.02,156.76) 148.51,156.25 148.51,154.48 148.62,154.36 U15.29 ; SW21.3 220.64,258.6 220.64,254.3 222.17,252.78 R81.1
  Bottom Layer w0.254: SW21.3 210.68,260.71 150.41,200.45 150.41,158.16 v1(149.02,156.76)
1_5: length 154.8
  Top Layer w0.254: SW20.3 272.64,111.3 R82.1 ; v1(157.02,149.27) 156.38,148.63 U15.19
  Bottom Layer w0.254: SW20.3 277.97,119.51 248.2,149.27 v1(157.02,149.27)
2_1: length 121.4
  Top Layer w0.254: 148.56,50.46 151.81,50.46 153.08,49.19 153.08,43.49 SW15.3 ; v1(145.46,142.67) 146.12,143.33 U15.3
  Bottom Layer w0.254: SW15.3 156.2,43.43 158.54,45.76 158.54,128.7 145.46,141.78 v1(145.46,142.67)
2_2: length 125.1
  Top Layer w0.254: v1(140.25,149.27) 140.63,149.65 141.78,149.65 142.3,149.13 U15.41 ; R70.1 54.48,115.77 SW14.3
  Bottom Layer w0.254: SW14.3 49.62,108.2 52.24,105.58 94.79,105.58 138.09,148.89 139.87,148.89 v1(140.25,149.27)
2_3: length 140.7
  Top Layer w0.254: 81.8,230.19 81.8,227.79 82.85,226.74 88.46,226.74 R71.1 ; U15.32 147.12,154.08 147.11,154.1 147.11,158.29 v1(147.49,158.67)
  Bottom Layer w0.254: v1(147.49,158.67) 147.49,160.32 140,167.81 114.47,167.81 69.64,212.64 69.64,217.85 81.8,230.01 81.8,230.19
2_4: length 127
  Top Layer w0.254: U15.28 149.12,154.5 149.02,154.6 149.02,155.62 v1(149.52,156.13) ; R72.1 203.37,229.99 203.37,234.22 SW12.3
  Bottom Layer w0.254: v1(149.52,156.13) 152.44,159.05 152.44,199.18 189.59,236.33 SW12.3
2_5: length 125.3
  Top Layer w0.254: R73.1 244.12,120.7 249.39,120.7 ; v1(157.52,148.63) 157.02,148.13 U15.18
  Bottom Layer w0.254: 249.39,120.7 249.39,132.33 233.09,148.63 v1(157.52,148.63)
3_1: length 94.7
  Top Layer w0.254: U15.46 142.19,146.63 141.65,146.09 v1(141.65,145.97) ; R64.1 150.29,80.69 152.83,78.15 SW2.3
  Bottom Layer w0.254: v1(141.65,145.97) 140.63,144.95 157.52,128.06 157.52,78.02 SW2.3
3_2: length 89.5
  Top Layer w0.254: v1(139.62,149.78) 140,150.16 141.9,150.16 142.43,149.63 U15.40 ; R65.1 83.18,123.06 80.68,120.56 SW19.3
  Bottom Layer w0.254: v1(139.62,149.78) 139.36,149.52 137.71,149.52 106.09,117.9 80.77,117.9 SW19.3
3_3: length 104.5
  Top Layer w0.254: U15.31 147.62,154.22 147.57,154.27 147.57,157.6 v1(148,158.03) ; 99.58,205.81 99.58,203.79 100.63,202.74 R66.1
  Bottom Layer w0.254: v1(148,158.03) 148.38,158.41 148.38,161.08 140.25,169.21 115.49,169.21 92.75,191.94 92.75,198.93 99.58,205.75 99.58,205.81
3_4: length 97.2
  Top Layer w0.254: U15.27 149.62,155.08 v1(150.03,155.49) ; R67.1 187.24,203.63 185.72,205.15 185.72,210.21 187.58,212.07
  Bottom Layer w0.254: 187.58,212.07 168.64,212.07 155.11,198.55 155.11,160.57 v1(150.03,155.49)
3_5: length 92.7
  Top Layer w0.254: R68.1 211.4,128.08 213.53,130.22 220.82,130.22 220.94,130.1 ; v1(151.05,141.65) 150.12,142.57 U15.11
  Bottom Layer w0.254: v1(151.05,141.65) 151.05,140.13 153.21,137.97 216.71,137.97 221.02,133.65 221.02,130.18 220.94,130.1
4_1: length 66.4
  Top Layer w0.254: SW7.3 152.95,106.72 150.67,109.01 R59.1 ; v1(141.14,146.73) 141.54,147.13 U15.45
  Bottom Layer w0.254: v1(141.14,146.73) 140.63,146.73 139.75,145.84 139.75,143.94 156.25,127.43 156.25,104.06 155.49,103.3 SW7.3
4_2: length 58.6
  Top Layer w0.254: 112.57,137.33 112.57,133.78 109.89,131.1 SW6.3 ; v1(138.98,150.29) 139.36,150.67 142.03,150.67 142.57,150.13 U15.39
  Bottom Layer w0.254: v1(138.98,150.29) 138.73,150.03 136.82,150.03 115.49,128.7 108.67,128.7 SW6.3
4_3: length 65.9
  Top Layer w0.254: 116.97,181.84 118.93,179.88 123.56,179.88 ; U15.30 148.12,154.25 148,154.37 148,156.89 v1(148.51,157.4)
  Bottom Layer w0.254: 116.97,181.84 114.6,179.48 114.6,173.4 117.9,170.1 140.89,170.1 149.14,161.84 149.14,158.03 v1(148.51,157.4)
4_4: length 58.9
  Top Layer w0.254: v1(150.54,154.86) 150.12,154.44 U15.26 ; R62.1 168.57,177.84 167.69,178.73 167.69,185.7 169.8,187.82
  Bottom Layer w0.254: v1(150.54,154.86) 157.52,161.84 157.52,181.78 163.56,187.82 169.8,187.82
4_5: length 53.7
  Top Layer w0.254: R63.1 188.19,140.39 SW3.3 ; U15.12 150.62,143.47 v1(151.81,142.28)
  Bottom Layer w0.254: v1(151.81,142.28) 190.85,142.28 SW3.3
5_1: length 39.7
  Top Layer w0.254: v1(141.52,148.25) 141.65,148.13 U15.43 ; SW10.3 152.95,127.68 149.91,130.73 R56.1
  Bottom Layer w0.254: SW10.3 152.95,129.84 139.11,143.68 139.11,146.73 140.07,147.69 140.96,147.69 v1(141.52,148.25)
5_2: length 31.6
  Top Layer w0.254: U15.38 142.7,150.63 142.15,151.18 138.73,151.18 v1(138.47,150.92) ; R57.1 126.04,156.89 124.66,155.51
  Bottom Layer w0.254: 124.66,155.51 124.66,152.93 127.04,150.54 138.09,150.54 v1(138.47,150.92)
5_3: length 27.7
  Top Layer w0.254: R58.1 161.84,158.97 161.84,160.03 165.91,164.1 ; U15.25 150.62,153.8 v1(151.3,154.48)
  Bottom Layer w0.254: 165.91,164.1 165.76,164.26 163.75,164.26 153.97,154.48 v1(151.3,154.48)
ACT: length 327.9
  Top Layer w0.254: v1(154.6,150.54) 154.22,150.16 152.15,150.16 U15.22 ; CN1.1 165.14,10.17 v1(165.14,12.11)
  Bottom Layer w0.254: v1(154.6,150.54) 157.14,153.08 251.63,153.08 285.41,119.3 285.41,101.65 278.81,95.04 243.95,95.04 165.14,16.24 v1(165.14,12.11)
DIN1: length 155.2
  Top Layer w0.254: U15.13 154.56,145.63 155.49,144.7 155.49,126.41 169.46,112.44 169.46,95.55 161.08,87.17 161.08,29.51 175.3,15.28 177.21,15.28 179.22,17.29 L37.4
DIN2: length 134.7
  Top Layer w0.254: U15.14 155.08,146.13 156.25,144.95 156.25,126.79 170.73,112.31 170.73,94.41 162.35,86.02 162.35,56.18 170.22,48.31 186.1,48.31 188.33,50.53 L35.4
DIN3: length 70.2
  Top Layer w0.254: U15.15 155.47,146.63 157.14,144.95 157.14,127.68 172.51,112.32 L9.4
DIN4: length 44.2
  Top Layer w0.254: U15.16 155.85,147.13 158.03,144.95 158.03,128.31 161.21,125.14 167.94,125.14 170.99,128.19 176.18,128.19 L17.4
DIN5: length 27.6
  Top Layer w0.254: U15.17 156.24,147.63 158.79,145.08 158.79,132.25 160.32,130.73 162.99,130.73 163.49,130.22 163.49,128.76 L15.4
HIT: length 333.2
  Top Layer w0.254: v1(163.78,12.07) 163.78,10.24 CN1.2 ; U15.21 154.97,149.63 v1(155.37,150.03)
  Bottom Layer w0.254: v1(163.78,12.07) 163.78,32.34 230.68,99.23 278.56,99.23 283.38,104.06 283.38,119.93 251,152.32 157.65,152.32 v1(155.37,150.03)
NRST: length 9.3
  Top Layer w0.254: U15.7 148.12,142.29 148.38,142.03 SW1.2 148.38,139.36 147.62,138.6 145.71,138.6 145.21,138.09 U5.2
SWCLK: length 145.6
  Top Layer w0.254: U1.2 7.53,147.75 v1(11.86,147.75) 12.49,147.75 13,147.24 R8.2 ; U15.37 142.84,151.13 142.28,151.68 v1(137.97,151.68)
  Bottom Layer w0.254: v1(11.86,147.75) 11.86,148.76 20.49,157.4 128.95,157.4 134.66,151.68 v1(137.97,151.68)
SWDIO: length 150.8
  Top Layer w0.254: R1.1 13,149.27 12.65,148.93 v1(9.41,148.93) 9.4,148.92 U1.3 ; v1(144.06,154.86) 145.02,154.86 146.12,153.75 U15.34
  Bottom Layer w0.254: v1(9.41,148.93) 9.41,150.12 17.32,158.03 140.89,158.03 v1(144.06,154.86)
$1N2663: length 19.2
  Top Layer w0.254: U15.5 147.12,142.55 145.46,140.89 141.78,140.89 141.01,141.65 141.01,142.54 140.76,142.79 137.97,142.79 135.55,145.21 X1.2
$1N2664: length 15.3
  Top Layer w0.254: U15.6 147.62,144.13 147.62,142.09 144.66,139.13 X1.1
$1N2668: length 5.8
  Top Layer w0.254: R3.1 156.9,150.03 156.01,149.14 154.99,149.14 154.98,149.13 U15.20
$1N2669: length 3.8
  Top Layer w0.254: R2.1 140.02,147.63 U15.44
$1N14230: length 16.1
  Top Layer w0.254: L55.1 121.31,79.53 120.06,78.28 116.5,78.28 114.47,80.31 C55.1 114.22,81.45 113.2,82.47 113.2,84.43 R55.2
$1N14233: length 37.9
  Top Layer w0.254: L55.4 121.31,89.73 114.85,96.18 98.85,96.18 94.42,100.62 L1.2
$1N15135: length 12.8
  Top Layer w0.254: R4.2 85.01,105.94 85.01,104.57 85.77,103.8 C3.1 85.96,102.22 86.79,101.39 90.72,101.39 91.42,102.09 L1.1
$1N15136: length 41.5
  Top Layer w0.254: L1.4 91.42,120.38 87.42,124.38 87.42,139.49 82.81,144.1 L2.2
$1N15772: length 14.8
  Top Layer w0.254: L2.1 79.8,146.37 79.8,144.32 79.55,144.06 75.48,144.06 74.53,145.02 C4.1 73.83,147.24 73.45,147.62 73.45,149.91 74.09,150.54 R5.2
$1N15776: length 16.2
  Top Layer w0.254: L3.1 88.27,179.72 88.06,179.5 82.72,179.5 81.64,180.58 C8.1 80.56,182.04 79.93,182.67 79.93,184.7 80.56,185.34 R6.2
$1N15778: length 34.8
  Top Layer w0.254: L2.4 79.81,159.95 91.27,171.41 L3.2
$1N15779: length 45.8
  Top Layer w0.254: 88.27,186.43 88.27,190 95.29,197.02 110.92,197.02 122.64,208.75 L4.2
$1N16353: length 15.3
  Top Layer w0.254: L4.1 122.64,212.86 121.71,213.79 116.38,213.79 115.94,213.35 R9.2 114.98,211.75 114.34,211.12 114.34,209.47 114.85,208.96 C9.1
$1N16357: length 12
  Top Layer w0.254: L5.1 168.34,209.82 166.86,211.31 C10.1 165.91,213.02 165.4,213.53 165.4,215.69 165.91,216.2 R10.2
$1N16359: length 45.6
  Top Layer w0.254: L4.4 146.63,211.86 151.66,206.82 L5.2
$1N16360: length 36
  Top Layer w0.254: L5.4 179.27,209.82 201.36,187.73 L6.2
$1N19976: length 9.1
  Top Layer w0.254: C11.1 206.67,181.84 206.67,184.3 R11.2 206.99,186.06 L6.1
$1N19979: length 11.2
  Top Layer w0.254: C12.1 220.14,147.62 219.63,148.13 219.63,149.96 R12.2 218.18,153.59 216.72,153.59 L7.1
$1N19981: length 31.9
  Top Layer w0.254: L6.4 204.36,177.23 209.47,172.13 209.47,155.99 L7.2
$1N19982: length 46.2
  Top Layer w0.254: L7.4 215.79,142.51 198.93,125.65 198.93,108.49 L8.2
$1N20579: length 11.4
  Top Layer w0.254: C13.1 206.17,103.61 206.17,105.33 207.13,106.29 R13.2 205.65,108.46 L8.1
$1N20582: length 17.2
  Top Layer w0.254: R14.2 164.76,85.13 164.26,84.63 164.26,81.83 164.76,81.32 C14.1 166.16,81.26 166.16,79.8 167.18,78.78 170.73,78.78 172.51,80.56 L9.1
$1N20584: length 41.4
  Top Layer w0.254: L9.2 175.51,80.74 176.57,79.67 184.19,79.67 201.95,97.43 L8.4
$1N21259: length 12.6
  Top Layer w0.254: 133.76,127.91 133.73,127.93 128.57,127.93 127.49,129.01 C15.1 126.16,131.43 126.16,132.51 126.79,133.14 R15.2
$1N21262: length 12.5
  Top Layer w0.254: L11.1 125.73,142.41 123.62,142.41 121.18,144.85 C16.1 120.85,146.07 120.19,146.73 120.19,148.05 R16.2
$1N21264: length 12.4
  Top Layer w0.254: L11.2 130.22,143.67 130.22,138.35 133.76,134.81 133.76,132.91
$1N21265: length 24
  Top Layer w0.254: L12.2 142.38,162.44 131.36,151.43 128.06,151.43 127.17,150.54 127.17,148.85 L11.4
$1N21809: length 10.2
  Top Layer w0.254: R17.2 134.41,169.34 133.78,168.7 133.78,167.11 C17.1 134.98,164.96 135.45,164.49 L12.1
$1N21812: length 13.3
  Top Layer w0.254: L13.1 157.37,170.96 158.16,171.75 161.21,171.75 162.04,170.91 R18.2 161.59,169.59 160.95,168.95 160.95,166.54 161.46,166.03 C18.1
$1N21814: length 20.2
  Top Layer w0.254: L12.4 139.49,169.6 139.49,171.88 140.89,173.27 152.19,173.27 154.37,171.09 L13.2
$1N21815: length 20.2
  Top Layer w0.254: L14.2 164.17,149.23 157.52,155.87 157.52,164.53 L13.4
$1N22363: length 12.6
  Top Layer w0.254: L14.1 169.06,150.77 169.72,151.43 172.76,151.43 173.53,150.67 173.53,148.43 R19.2 172.64,147.54 172.64,146.48 173.59,145.53 C19.1
$1N22366: length 14.9
  Top Layer w0.254: 163.49,133.89 163.49,135.81 164.26,136.57 166.29,136.57 168.07,134.79 168.07,132.3 168.01,132.25 167.18,132.25 166.16,131.24 166.16,130.41 167.37,129.2
$1N22368: length 16.5
  Top Layer w0.254: L15.2 160.57,133.84 160.57,136.95 161.59,137.97 165.65,137.97 169.08,141.4 169.08,144.21 L14.4
$1N23436: length 13.2
  Top Layer w0.254: L16.1 179.47,172.23 180.51,173.27 183.69,173.27 184.52,172.44 R21.2 184.52,166.29 C21.1
$1N23439: length 14.8
  Top Layer w0.254: L17.1 176.22,121.1 174.8,119.68 172.51,119.68 171.88,120.31 171.88,123.17 C22.1 171.11,123.23 170.73,123.62 170.73,125.9 171.11,126.28 R22.2
$1N23441: length 45.1
  Top Layer w0.254: L16.4 181.78,163.89 181.78,125.71 L17.2
$1N24613: length 9.6
  Top Layer w0.254: R23.2 155.11,112.37 155.11,111.17 155.94,110.35 C23.1 155.94,109.33 156.38,108.89 L18.1
$1N24616: length 13.2
  Top Layer w0.254: R24.2 126.54,111.93 126.16,111.55 126.16,109.37 C24.1 127.28,106.75 127.81,106.22 130.2,106.22 L19.1
$1N24618: length 32
  Top Layer w0.254: L19.2 135.78,107.64 136.7,106.72 139.75,106.72 148.89,115.87 160.19,115.87 160.93,115.13 L18.4
$1N24621: length 14.1
  Top Layer w0.254: R25.2 111.3,126.84 111.3,125.14 112.44,124 112.75,124 112.75,122.8 114.34,121.2 116.63,121.2 118.04,122.61 L20.1
$1N24624: length 18.8
  Top Layer w0.254: L21.1 117.8,163.39 116.38,161.97 110.92,161.97 110.29,162.59 C26.1 109.52,164 108.88,164.64 108.88,166.67 109.52,167.3 110.05,167.3
$1N24626: length 39.9
  Top Layer w0.254: L21.2 120.8,164.49 118.04,161.73 L20.4
$1N24628: length 12.5
  Top Layer w0.254: L22.1 137.25,178.99 132.76,178.99 132.34,179.41 C27.1 131.87,180.64 131.36,181.15 131.36,183.36 R27.2
$1N24631: length 13.8
  Top Layer w0.254: R28.2 151.68,184.07 151.17,183.56 151.17,181.4 152.06,180.51 C28.1 153.14,179.56 154.22,178.48 157.25,178.48 L23.1
$1N24633: length 40.5
  Top Layer w0.254: L22.4 138.27,187.67 140.38,189.78 161.33,189.78 164.89,186.23 164.89,181.27 163.41,179.79 L23.2
$1N24634: length 26.7
  Top Layer w0.254: L16.2 166.84,171.2 160.06,177.97 160.06,183.29 158.56,184.79
$1N24635: length 29.3
  Top Layer w0.254: L21.4 117.8,175.58 120.06,177.84 140.38,177.84 141.27,178.73 141.27,180 L22.2
$1N24636: length 18.5
  Top Layer w0.254: L20.2 121.04,118.95 123.49,116.5 130.08,116.5 L19.4
$1N26867: length 17.3
  Top Layer w0.254: L24.1 116.78,48.46 115.23,46.91 111.68,46.91 111.1,47.48 C29.1 109.9,49.57 109.01,50.46 109.01,53.13 109.9,54.02 R29.2
$1N26871: length 17.5
  Top Layer w0.254: L25.1 86.34,66.14 85.01,64.81 81.32,64.81 80.24,65.9 C30.1 79.42,67.61 78.66,68.37 78.66,71.93 79.29,72.56 R30.2
$1N26873: length 36.4
  Top Layer w0.254: L24.4 116.78,56.92 113.71,59.99 93.26,59.99 89.2,64.05 89.2,67.5 L25.2
$1N26877: length 17.5
  Top Layer w0.254: R33.2 58.72,205.66 58.21,205.15 58.21,201.59 58.85,200.96 C33.1 60.05,199.5 60.88,198.67 64.94,198.67 66.38,200.12 L28.1
$1N26880: length 22.1
  Top Layer w0.254: L29.1 114.37,237.56 113.58,236.77 109.14,236.77 108.31,237.6 C34.1 105.71,240.2 104.69,241.22 104.69,244.39 105.58,245.28 107.99,245.28 R34.2
$1N26882: length 68
  Top Layer w0.254: L29.2 117.37,236.62 115.61,234.87 107.36,234.87 93.14,220.64 77.64,220.64 66.38,209.39 L28.4
$1N26883: length 52.6
  Top Layer w0.254: 69.38,201.24 69.38,194.86 49.79,175.27 L27.4
$1N26885: length 19.3
  Top Layer w0.254: 42.49,155.11 41.57,155.11 40.3,153.84 40.3,151.68 41.32,150.67 C32.1 42.59,150.6 42.59,149.27 43.48,148.38 48.81,148.38 49.79,149.36 L27.1
$1N26886: length 27.2
  Top Layer w0.254: L25.4 86.34,75.16 86.4,75.23 79.67,81.96 72.82,81.96 71.01,83.76 L26.2
$1N26887: length 63.7
  Top Layer w0.254: L27.2 52.75,151.67 52.75,143.81 58.21,138.35 58.21,109.77 68.01,99.97 L26.4
$1N26889: length 16.4
  Top Layer w0.254: L26.1 68.01,87.95 66.72,86.66 63.8,86.66 62.46,88 C31.1 61.63,89.2 60.75,90.09 60.75,93.26 61.64,94.15 R31.2
$1N26891: length 14.1
  Top Layer w0.254: 180.57,239.95 179.62,239.95 179.11,240.46 179.11,243.38 179.88,244.14 R35.2 180.46,245.33 178.99,246.81 177.08,246.81 175.92,245.64 L30.1
$1N26894: length 17.6
  Top Layer w0.254: C36.1 226.99,214.68 226.23,215.44 226.23,217.22 226.99,217.98 R36.2 228.08,219.17 226.36,220.9 221.02,220.9 220.49,220.37 L31.1
$1N26896: length 52.4
  Top Layer w0.254: L30.4 175.92,237.18 179.88,233.22 195.62,233.22 207.31,221.53 216.2,221.53 217.49,220.24 L31.2
$1N26898: length 18
  Top Layer w0.254: L32.1 240.81,187.6 241.22,188 245.66,188 246.68,186.99 246.68,185.79 R37.2 245.92,185.72 245.28,185.08 245.28,180.26 246.04,179.5 C37.1
$1N26901: length 17
  Top Layer w0.254: L33.1 245.66,149.51 245.66,151.18 246.3,151.81 248.84,151.81 250.56,150.08 R38.2 ; R38.2 249.85,149.02 249.09,148.25 249.09,143.94 249.85,143.17 C38.1 ; R38.2 250.44,149.14
$1N26903: length 32.4
  Top Layer w0.254: L33.2 240.71,151.41 240.71,180.96 L32.4
$1N26904: length 59.5
  Top Layer w0.254: L33.4 245.66,144.46 245.66,133.78 237.41,125.52 237.41,111.42 224.48,98.49 L34.2
$1N26905: length 34.9
  Top Layer w0.254: L32.2 226.1,197.77 226.1,205.4 220.49,211.02 L31.4
$1N26906: length 64.1
  Top Layer w0.254: L29.4 114.34,244.25 114.34,246.68 115.74,248.08 171.24,248.08 172.92,246.4 L30.2
$1N28307: length 16.3
  Top Layer w0.254: C39.1 232.84,87.93 232.33,88.44 232.33,91.87 232.84,92.37 R39.2 233.55,93.31 230.93,95.93 228.39,95.93 227.48,95.02 L34.1
$1N28310: length 22.9
  Top Layer w0.254: L35.1 188.26,57.27 188.26,58.59 190.16,60.5 194.99,60.5 197.1,58.39 R40.2 195.88,56.69 194.86,55.67 194.86,51.99 195.88,50.97 C40.1
$1N28312: length 59.3
  Top Layer w0.254: L35.2 185.33,60.23 191.43,66.34 209.09,66.34 227.48,84.73 L34.4
$1N28912: length 20.3
  Top Layer w0.254: C41.1 222.17,38.27 221.66,38.78 221.66,43.22 222.17,43.73 R41.2 223.77,45.56 222.42,46.91 218.36,46.91 216.97,45.52 L36.1
$1N28915: length 17.6
  Top Layer w0.254: L37.1 179.22,25.8 179.75,26.33 183.94,26.33 184.65,25.62 R42.2 183.31,23.16 182.92,22.78 182.92,19.09 183.56,18.46 C42.1
$1N28917: length 50.1
  Top Layer w0.254: L36.4 217.09,39.34 217.09,37 212.64,32.56 181.91,32.56 176.22,26.87 L37.2
$1N30856: length 17.5
  Top Layer w0.254: R43.2 109.14,23.67 108.5,23.03 108.5,20.11 109.14,19.48 C43.1 110.34,18.4 111.68,17.06 116.5,17.06 117.63,18.19 L38.1
$1N30860: length 17.2
  Top Layer w0.254: R44.2 67.48,41.83 66.85,41.19 66.85,38.4 67.86,37.38 68.75,37.38 68.62,37.26 68.62,36.11 69.39,35.35 72.43,35.35 74.91,37.82 L39.1
$1N30862: length 47.9
  Top Layer w0.254: L38.4 117.63,25.59 113.46,29.76 85.01,29.76 77.77,37 77.77,38.92 L39.2
$1N30866: length 17.3
  Top Layer w0.254: L42.1 24.6,182.21 22.78,180.38 19.22,180.38 18.33,181.27 18.33,182.86 C47.1 17.32,182.93 16.55,183.69 16.55,186.74 17.06,187.24 R47.2
$1N30869: length 17.8
  Top Layer w0.254: R48.2 45.26,235.5 44.49,234.74 44.49,231.44 45.13,230.8 46.21,230.8 46.21,228.84 47.67,227.38 50.84,227.38 52.24,228.77 L43.1
$1N30871: length 54.7
  Top Layer w0.254: L42.4 24.6,195.92 55.24,226.56 L43.2
$1N30872: length 52
  Top Layer w0.254: L42.2 27.6,183.33 27.6,174.67 21.25,168.32 21.25,135.72 L41.4
$1N30874: length 20.4
  Top Layer w0.254: R46.2 14.01,135.17 13.38,134.54 13.38,129.2 14.14,128.44 C46.1 14.9,128.38 14.9,127.17 15.67,126.41 21.51,126.41 22.49,127.39 L41.1
$1N30875: length 33.6
  Top Layer w0.254: L39.4 65.58,53.38 59.23,53.38 52.59,60.03 L40.2
$1N30876: length 69.8
  Top Layer w0.254: L41.2 25.49,118.62 31.03,113.07 31.03,92.5 49.59,73.95 L40.4
$1N30878: length 19.1
  Top Layer w0.254: R45.2 42.46,69.9 41.57,69.01 41.57,65.96 42.34,65.2 C45.1 43.48,65.13 43.48,62.4 44.37,61.51 48.05,61.51 49.59,63.05 L40.1
$1N30880: length 23.1
  Top Layer w0.254: L44.1 103.83,266.26 101.77,264.2 94.15,264.2 93.14,265.22 93.14,267.06 C49.1 91.61,267.13 90.98,267.76 90.98,271.06 91.99,272.08 R49.2
$1N30883: length 17.3
  Top Layer w0.254: C50.1 188.51,267.25 187.88,267.89 187.88,271.44 188.39,271.95 189.3,271.95 189.27,271.98 189.27,274.24 188.39,275.13 184.19,275.13 183.54,274.47 L45.1
$1N30885: length 83.6
  Top Layer w0.254: L44.4 103.83,274.52 106.72,277.41 178.99,277.41 180.51,275.89 180.51,272.95 L45.2
$1N30887: length 18.4
  Top Layer w0.254: L46.1 240.3,239.8 241.09,240.58 245.66,240.58 246.58,239.67 R51.2 245.54,237.15 244.65,236.26 244.65,233.72 245.41,232.96 C51.1
$1N30890: length 20.3
  Top Layer w0.254: C52.1 275.89,182.42 274.87,183.43 274.87,187.5 275.89,188.51 276.67,188.51 276.65,188.54 276.65,190.67 275.63,191.69 270.43,191.69 269.51,190.78 L47.1
$1N30892: length 54.8
  Top Layer w0.254: L46.4 240.3,228.03 266.51,201.82 L47.2
$1N30893: length 68.2
  Top Layer w0.254: L46.2 237.3,239.8 234.23,242.87 223.95,242.87 202.74,264.08 185.21,264.08 183.54,265.75 L45.4
$1N30894: length 70.9
  Top Layer w0.254: L43.4 52.24,237.79 62.78,248.33 77.13,248.33 89.33,260.52 102.66,260.52 106.83,264.69 L44.2
$1N30896: length 17.9
  Top Layer w0.254: 282.11,134.87 R53.2 ; 282.11,134.87 282.11,136.19 280.33,137.97 276.27,137.97 275.23,136.93 L48.1 ; 282.11,134.87 282.04,134.79 281.35,134.79 280.71,134.16 280.71,130.35 281.1,129.97 C53.1
$1N30899: length 19.9
  Top Layer w0.254: L49.1 248.94,73.81 249.6,74.47 254.05,74.47 254.81,73.71 254.81,70.84 R54.2 254.05,70.78 253.28,70.02 253.28,65.2 253.79,64.69 C54.1
$1N30901: length 71.1
  Top Layer w0.254: L49.2 245.94,75.25 262.68,91.99 262.68,111.68 275.23,124.23 L48.4
$1N30902: length 47.6
  Top Layer w0.254: L36.2 213.97,46.96 220.14,53.13 238.42,53.13 248.94,63.65 L49.4
$1N30903: length 50.8
  Top Layer w0.254: L48.2 270.34,135.89 269.41,136.82 269.41,184.26 L47.4

## Copper pours and planes (outline as drawn; the poured copper is in the pictures)
+3.3V on Top Layer: 127.55,40.56 135.68,40.56 135.68,33.95 127.55,33.95
+5V on Top Layer: outline of 384 points within 0.83,1.34 295.17,295.67
AGND on Bottom Layer: outline of 384 points within 0.52,1.92 294.72,296.11

## Text on the board
Top Silkscreen Layer: GND | CLK | 3V3 | DIO | HIT | ACT | 5V
